# EAGLE design SoM_Breakout (EAGLE 9.6.2)
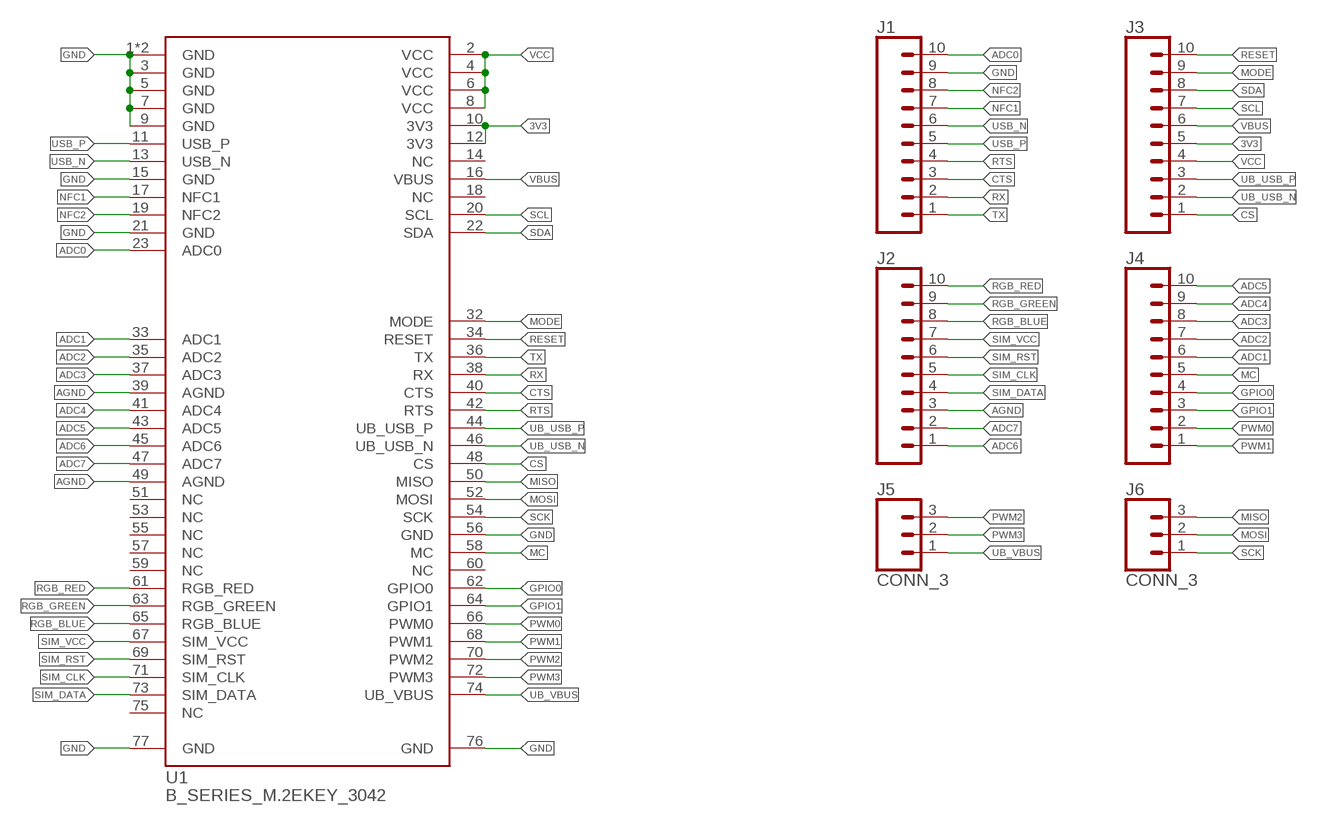
[diagram p0: schematic, sheet 1]

## Parts
J1  CONN_10"  [1X10]
J2  CONN_10"  [1X10]
J3  CONN_10"  [1X10]
J4  CONN_10"  [1X10]
J5  CONN_3  [1X03]
J6  CONN_3  [1X03]
U1  B_SERIES_M.2EKEY_3042  [PARTICLE_M.2EKEY]

## Nets
3V3: J3.5 U1.10(3V3) U1.12(3V3)
ADC0: J1.10 U1.23(ADC0)
ADC1: J4.6 U1.33(ADC1)
ADC2: J4.7 U1.35(ADC2)
ADC3: J4.8 U1.37(ADC3)
ADC4: J4.9 U1.41(ADC4)
ADC5: J4.10 U1.43(ADC5)
ADC6: J2.1 U1.45(ADC6)
ADC7: J2.2 U1.47(ADC7)
AGND: J2.3 U1.39(AGND) U1.49(AGND)
CS: J3.1 U1.48(CS)
CTS: J1.3 U1.40(CTS)
GND: J1.9 U1.1(GND) U1.3(GND) U1.5(GND) U1.7(GND) U1.9(GND) U1.15(GND) U1.21(GND) U1.56(GND) U1.76(GND) U1.77(GND) U1.GND
GPIO0: J4.4 U1.62(GPIO0)
GPIO1: J4.3 U1.64(GPIO1)
MC: J4.5 U1.58(MC)
MISO: J6.3 U1.50(MISO)
MODE: J3.9 U1.32(MODE)
MOSI: J6.2 U1.52(MOSI)
NFC1: J1.7 U1.17(NFC1)
NFC2: J1.8 U1.19(NFC2)
PWM0: J4.2 U1.66(PWM0)
PWM1: J4.1 U1.68(PWM1)
PWM2: J5.3 U1.70(PWM2)
PWM3: J5.2 U1.72(PWM3)
RESET: J3.10 U1.34(RESET)
RGB_BLUE: J2.8 U1.65(RGB_BLUE)
RGB_GREEN: J2.9 U1.63(RGB_GREEN)
RGB_RED: J2.10 U1.61(RGB_RED)
RTS: J1.4 U1.42(RTS)
RX: J1.2 U1.38(RX)
SCK: J6.1 U1.54(SCK)
SCL: J3.7 U1.20(SCL)
SDA: J3.8 U1.22(SDA)
SIM_CLK: J2.5 U1.71(SIM_CLK)
SIM_DATA: J2.4 U1.73(SIM_DATA)
SIM_RST: J2.6 U1.69(SIM_RST)
SIM_VCC: J2.7 U1.67(SIM_VCC)
TX: J1.1 U1.36(TX)
UB_USB_N: J3.2 U1.46(UB_USB_N)
UB_USB_P: J3.3 U1.44(UB_USB_P)
UB_VBUS: J5.1 U1.74(UB_VBUS)
USB_N: J1.6 U1.13(USB_N)
USB_P: J1.5 U1.11(USB_P)
VBUS: J3.6 U1.16(VBUS)
VCC: J3.4 U1.2(VCC) U1.4(VCC) U1.6(VCC) U1.8(VCC)
Unconnected: U1.14(NC) U1.18(NC) U1.51(NC) U1.53(NC) U1.55(NC) U1.57(NC) U1.59(NC) U1.60(NC) U1.75(NC) U1.!RESET U1.SWCLK U1.SWDIO U1.SWO

## Library data of the parts
J1-J4 = bschulz:CONN_10: Genaric 10 terminal header Digikey 2.54_SCREW <https://www.digikey.com/product-detail/en/on-shore-technology-inc/OSTVN10A150/ED10567-ND/1588870> 3.5_SCREW <https://www.digikey.com/product-detail/en/on-shore-technology-inc/OSTTE100104/ED2735-ND/2351811>; PROD_ID: CONN-11563
J5 J6 = bschulz:CONN_3: Genaric 3 terminal header Digikey 2.54_SCREW <https://www.digikey.com/product-detail/en/on-shore-technology-inc/OSTVN03A150/ED10562-ND/1588863> 3.5_SCREW <https://www.digikey.com/product-detail/en/on-shore-technology-inc/OSTTE030161/ED2636-ND/614585>
U1 = Particle-Devices:B_SERIES_M.2EKEY_: Particle B Series SoM 3042 M.2 Connector with E Key Width = 30mm Length = 42mm Height = 4.2mm Key = E

## Board
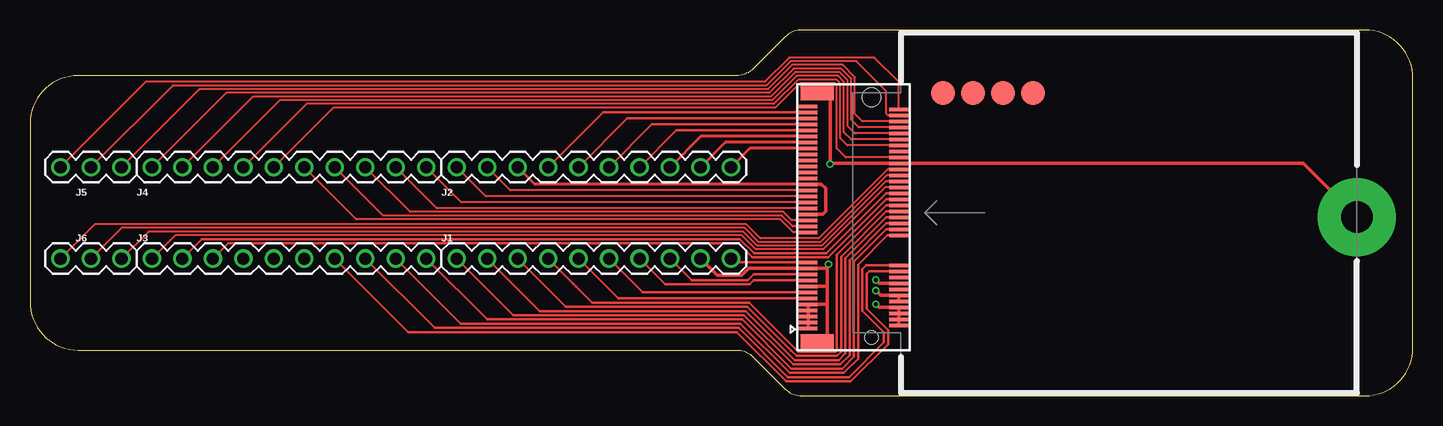
[diagram p1: board, top side]
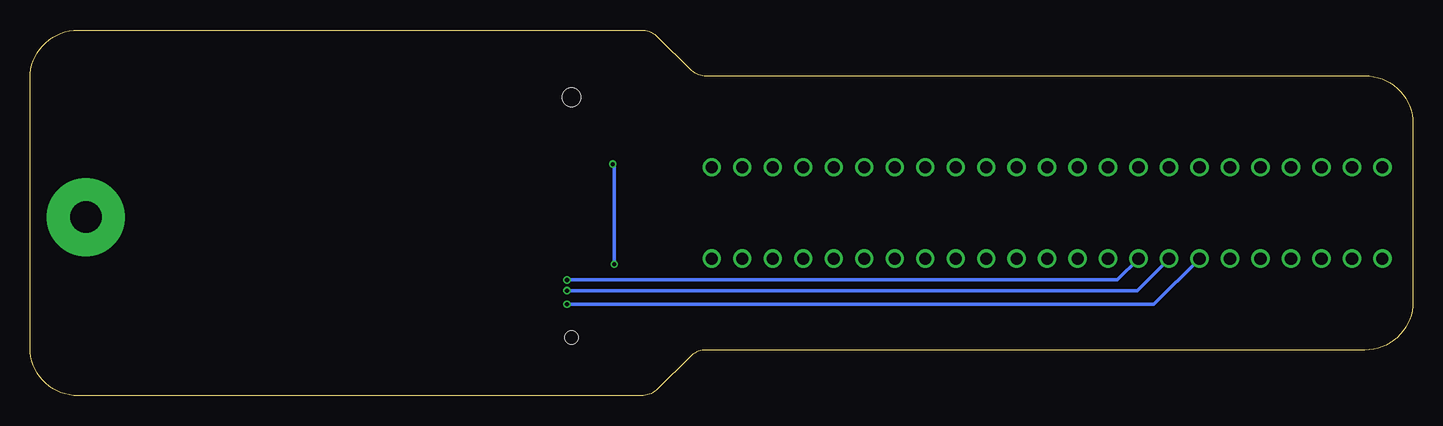
[diagram p2: board, bottom side, seen from below]

Size 115.24 x 30.48 mm. Coordinates in mm from the lower left corner, seen from the top.
Outline: 64.33,0 111.24,0 arc90 115.24,4 115.24,26.48 arc90 111.24,30.48 64.33,30.48 arc45 62.91,29.89 60.28,27.26 arc-45 58.86,26.67 4,26.67 arc90 0,22.67 0,7.81 arc90 4,3.81 58.86,3.81 arc-45 60.28,3.22 62.91,0.59 arc45 64.33,0
Copper layers (1*16): Top 0.035559375mm / dielectric 1.6mm / Bottom 0.035559375mm
Design rules "oshpark-2layer": minimum track width 6mil, minimum drill 10mil, track to track 6mil, track to pad 6mil, pad to pad 6mil, via to via 6mil, smd to smd 6mil, copper to edge 15mil, drill to drill 6mil, minimum pad ring 5mil, minimum via ring 5mil, stop-mask expansion 2.5mil, vias tented up to drill 0mil, thermal gap 10mil

### Footprints (pad centres in the part's own frame; a part is rotated, then mirrored left to right if it is on the bottom)
1X10 = drill 1.016: 1 0,0; 2 2.54,0; 3 5.08,0; 4 7.62,0; 5 10.16,0; 6 12.7,0; 7 15.24,0; 8 17.78,0; 9 20.32,0; 10 22.86,0
1X03 = drill 1.016: 1 -2.54,0; 2 0,0; 3 2.54,0
PARTICLE_M.2EKEY = smd 0.3 x 1.55: 1 -9.62,3.735; 2 -9.37,-3.815; 3 -9.12,3.735; 4 -8.87,-3.815; 5 -8.62,3.735; 6 -8.37,-3.815; 7 -8.12,3.735; 8 -7.87,-3.815; 9 -7.62,3.735; 10 -7.37,-3.815; 11 -7.12,3.735; 12 -6.87,-3.815; 13 -6.62,3.735; 14 -6.37,-3.815; 15 -6.12,3.735; 16 -5.87,-3.815; 17 -5.62,3.735; 18 -5.37,-3.815; 19 -5.12,3.735; 20 -4.87,-3.815; 21 -4.62,3.735; 22 -4.37,-3.815; 23 -4.12,3.735; 32 -1.87,-3.815; 33 -1.62,3.735; 34 -1.37,-3.815; 35 -1.12,3.735; 36 -0.87,-3.815; 37 -0.62,3.735; 38 -0.37,-3.815; 39 -0.12,3.735; 40 0.13,-3.815; 41 0.38,3.735; 42 0.63,-3.815; 43 0.88,3.735; 44 1.13,-3.815; 45 1.38,3.735; 46 1.63,-3.815; 47 1.88,3.735; 48 2.13,-3.815; 49 2.38,3.735; 50 2.63,-3.815; 51 2.88,3.735; 52 3.13,-3.815; 53 3.38,3.735; 54 3.63,-3.815; 55 3.88,3.735; 56 4.13,-3.815; 57 4.38,3.735; 58 4.63,-3.815; 59 4.88,3.735; 60 5.13,-3.815; 61 5.38,3.735; 62 5.63,-3.815; 63 5.88,3.735; 64 6.13,-3.815; 65 6.38,3.735; 66 6.63,-3.815; 67 6.88,3.735; 68 7.13,-3.815; 69 7.38,3.735; 70 7.63,-3.815; 71 7.88,3.735; 72 8.13,-3.815; 73 8.38,3.735; 74 8.63,-3.815; 75 8.88,3.735 | smd 1.2 x 2.75: 76 9.98,2.96; 77 -10.72,2.96 | smd 2 x 2: !RESET 10,-7.5; SWCLK 10,-15; SWDIO 10,-12.5; SWO 10,-10 | drill 2.6 pad 6.5: GND -0.351,-42 | hole 1.1: -10.37,-1.54 | hole 1.55: 9.63,-1.54

### Placement (x,y rotation side)
J1  35.56,11.43 0 top
J2  35.56,19.05 0 top
J3  10.16,11.43 0 top
J4  10.16,19.05 0 top
J5  5.08,19.05 0 top
J6  5.08,11.43 0 top
U1  68.58,15.24 90 top

### Tracks (layer width: path | path; a pad name or v marks a point on that pad's centre or on a via)
3V3  (via drill 0.35)
  Top 0.305: U1.10 U1.12 70.88,8.37 v70.48,8.76
  Bottom 0.305: v70.48,8.76 22.99,8.76 J3.5
ADC0
  Top 0.2: U1.23 58.73,11.12 J1.10
ADC1
  Top 0.152: U1.33 63.62,13.62 62.54,14.71 27.2,14.71 J4.6
ADC2
  Top 0.152: U1.35 63.55,14.12 62.66,15.01 29.44,15.01 J4.7
ADC3
  Top 0.152: U1.37 63.48,14.62 62.79,15.31 31.68,15.31 J4.8
ADC4
  Top 0.152: U1.41 33.91,15.62 J4.9
ADC5
  Top 0.152: U1.43 35.95,16.12 J4.10
ADC6
  Top 0.152: U1.45 37.99,16.62 J2.1
ADC7
  Top 0.152: U1.47 40.03,17.12 J2.2
AGND
  Top 0.254: U1.49 42.07,17.62 J2.3
  Top 0.305: U1.39 66.05,15.12 66.29,15.37 66.29,17.27 65.95,17.62 U1.49
CS
  Top 0.152: U1.48 71.26,17.37 66.09,12.2 60.48,12.2 59.3,13.38 12.11,13.38 J3.1
CTS
  Top 0.2: U1.40 71.37,15.37 67.6,11.6 67.6,3.67 67.25,3.31 63.88,3.31 63.44,3.75 59.78,7.42 44.66,7.42 J1.3
GND  (via drill 0.35)
  Top 0.305: U1.1 U1.3 U1.5 U1.7 U1.9 66.42,7.62 | U1.77 66,4.52 66.42,4.94 66.42,7.62 | 66.42,10.54 66.42,10.84 v66.55,10.97 | 66.42,10.54 66.42,9.14 | 66.42,9.14 66.42,7.62 | U1.15 66.4,9.12 66.42,9.14 | J1.9 57.27,10.04 59.31,10.04 59.9,10.62 U1.21 66.34,10.62 66.42,10.54 | U1.76 66.51,25.22 66.67,25.05 v66.67,19.3 66.74,19.37 U1.56 106.1,19.37 U1.GND
  Bottom 0.305: v66.55,10.97 66.55,19.18 v66.67,19.3
GPIO0
  Top 0.152: U1.62 68.12,20.87 67.53,21.46 67.53,26.04 67.22,26.35 64.02,26.35 61.99,24.32 23.05,24.32 J4.4
GPIO1
  Top 0.152: U1.64 68.43,21.37 67.83,21.97 67.83,26.17 67.34,26.66 63.9,26.66 61.86,24.63 20.82,24.63 J4.3
MC
  Top 0.152: U1.58 67.97,19.86 67.22,20.61 67.22,25.91 67.09,26.05 64.15,26.05 62.12,24.02 25.29,24.02 J4.5
MISO
  Top 0.152: U1.50 71.33,17.87 65.97,12.51 60.61,12.51 59.43,13.69 9.88,13.69 J6.3
MODE
  Top 0.2: U1.32 71.46,13.37 69.01,10.92 69.01,3.09 67.83,1.91 63.29,1.91 59.19,6.01 35.9,6.01 J3.9
MOSI
  Top 0.152: U1.52 71.4,18.37 65.84,12.81 60.73,12.81 59.55,13.99 7.64,13.99 J6.2
NFC1
  Top 0.2: U1.17 60.31,9.62 59.97,9.28 52.95,9.28 J1.7
NFC2
  Top 0.2: U1.19 60.31,10.12 59.82,9.63 55.14,9.63 J1.8
PWM0
  Top 0.152: U1.66 68.75,21.87 68.14,22.48 68.14,26.29 67.47,26.96 63.77,26.96 61.74,24.93 18.58,24.93 J4.2
PWM1
  Top 0.152: U1.68 69.06,22.37 68.44,22.99 68.44,26.42 67.59,27.27 63.64,27.27 61.61,25.24 16.35,25.24 J4.1
PWM2
  Top 0.152: U1.70 69.37,22.87 68.75,23.5 68.75,26.55 67.72,27.57 63.52,27.57 61.48,25.54 14.11,25.54 J5.3
PWM3
  Top 0.152: U1.72 71.5,23.37 71.35,23.52 71.35,25.38 68.86,27.88 63.39,27.88 61.36,25.84 11.88,25.84 J5.2
RESET
  Top 0.2: U1.34 71.36,13.87 68.66,11.16 68.66,3.23 67.68,2.26 63.44,2.26 59.34,6.36 38.09,6.36 J3.10
RGB_BLUE
  Top 0.254: U1.65 55.91,21.62 J2.8
RGB_GREEN
  Top 0.254: U1.63 57.95,21.12 J2.9
RGB_RED
  Top 0.254: U1.61 59.99,20.62 J2.10
RTS
  Top 0.2: U1.42 71.37,15.87 67.25,11.75 67.25,3.81 67.1,3.67 64.02,3.67 59.92,7.77 46.84,7.77 45.54,9.07 45.28,9.34 J1.4
RX
  Top 0.2: U1.38 71.37,14.87 67.95,11.46 67.95,3.52 67.39,2.96 63.73,2.96 59.63,7.06 42.47,7.06 J1.2
SCK
  Top 0.152: U1.54 71.47,18.87 65.72,13.12 60.86,13.12 59.68,14.29 5.41,14.29 J6.1
SCL
  Top 0.2: U1.20 69.92,10.37 69.71,10.16 69.71,7.23 71.5,5.44 71.5,4.3 68.41,1.2 63,1.2 58.9,5.3 31.53,5.3 J3.7
SDA
  Top 0.2: U1.22 69.69,10.87 69.36,10.54 69.36,7.09 71.15,5.3 71.15,4.44 68.26,1.55 63.15,1.55 59.05,5.65 33.72,5.65 J3.8
SIM_CLK
  Top 0.2: U1.71 49.79,23.12 J2.5
SIM_DATA
  Top 0.2: U1.73 47.75,23.62 J2.4
SIM_RST
  Top 0.2: U1.69 51.83,22.62 J2.6
SIM_VCC
  Top 0.2: U1.67 53.87,22.12 J2.7
TX
  Top 0.2: U1.36 71.36,14.37 68.31,11.31 68.31,3.38 67.54,2.61 63.59,2.61 59.48,6.71 40.28,6.71 J1.1
UB_USB_N
  Top 0.2: U1.46 71.35,16.87 66.36,11.88 60.34,11.88 59.17,13.05 14.32,13.05 J3.2
UB_USB_P
  Top 0.2: U1.44 71.36,16.37 66.51,11.52 60.2,11.52 59.02,12.7 16.51,12.7 J3.3
UB_VBUS
  Top 0.152: U1.74 72.39,26.16 70.37,28.18 63.27,28.18 61.23,26.15 9.64,26.15 J5.1
USB_N
  Top 0.2: U1.13 51.07,8.62 J1.6
USB_P
  Top 0.2: U1.11 49.03,8.12 J1.5
VBUS  (via drill 0.35)
  Top 0.305: U1.16 70.77,9.37 v70.48,9.65
  Bottom 0.305: v70.48,9.65 24.64,9.65 J3.6
VCC  (via drill 0.35)
  Top 0.305: U1.2 U1.4 U1.6 U1.8 70.73,7.37 v70.48,7.62
  Bottom 0.305: v70.48,7.62 21.59,7.62 J3.4

### Text on the board
tDocu: Break44 | J7 | UB_VBUS | PWM3 | PWM2 | PWM1 | PWM0 | GPIO1 | GPIO0 | MC | ADC1 | ADC2 | ADC3 | ADC4 | ADC5 | ADC6 | ADC7 | AGND | SIM_DATA | SIM_CLK | SIM_RST | SIM_VCC | RGB_BLUE | RGB_GRN | RGB_RED | SCK | MOSI | MISO | CS | UB_USB_N | UB_USB_P | VCC | 3V3 | VUSB | SCL | SDA | MODE | RESET | TX | RX | CTS | RTS | USB_P | USB_N | NFC1 | NFC2 | GND | ADC0 | M.2 SoM Breakout / v0.0 / B. Schulz